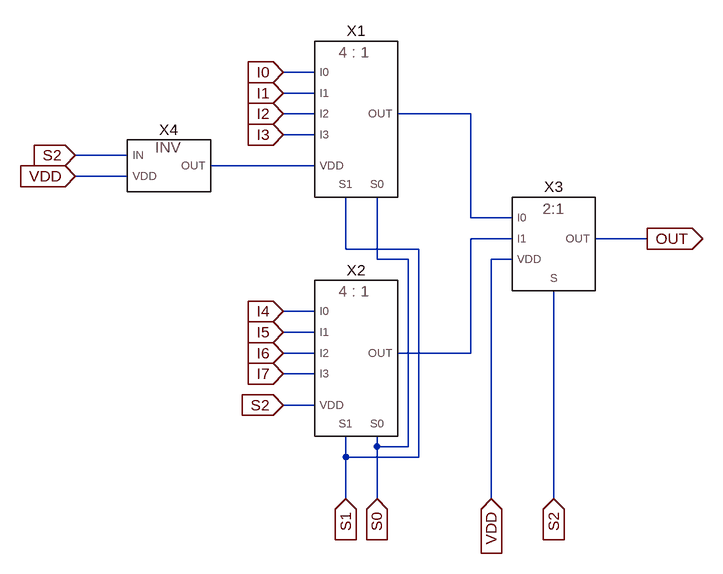
[diagram p0: schematic Mux8to1CMOS.asc]
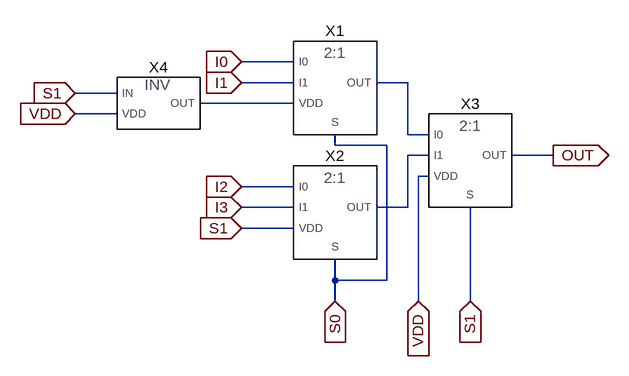
[diagram p1: sub-circuit mux4to1cmos.asc]
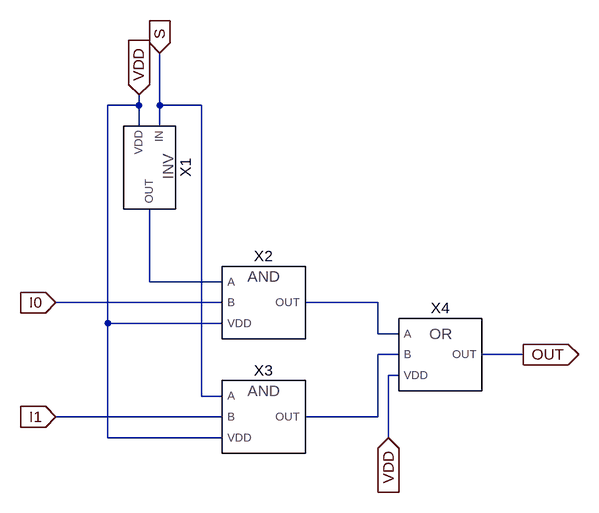
[diagram p2: sub-circuit mux2to1cmos.asc]
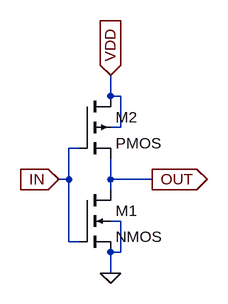
[diagram p3: sub-circuit invcmos.asc]
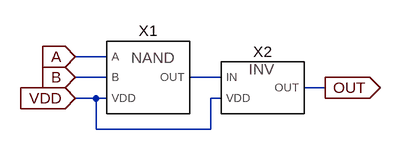
[diagram p4: sub-circuit andcmos.asc]
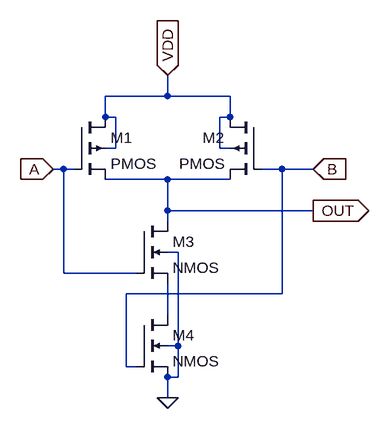
[diagram p5: sub-circuit nandcmos.asc]
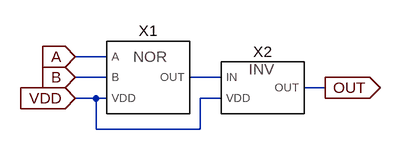
[diagram p6: sub-circuit orcmos.asc]
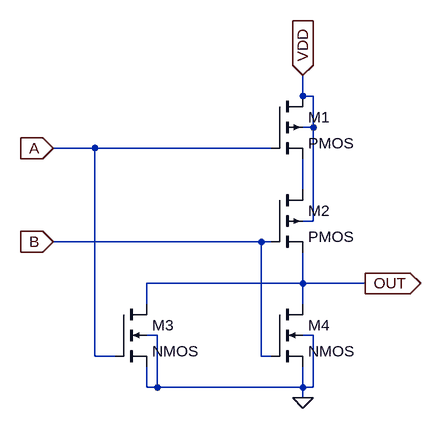
[diagram p7: sub-circuit norcmos.asc]
Mux8to1CMOS.asc, the LTspice schematic file:
Version 4
SHEET 1 880 812
WIRE 176 48 128 48
WIRE 176 80 128 80
WIRE 176 112 128 112
WIRE 416 112 304 112
WIRE 176 144 128 144
WIRE -112 176 -192 176
WIRE 176 192 16 192
WIRE -112 208 -192 208
WIRE 416 272 416 112
WIRE 480 272 416 272
WIRE 480 304 416 304
WIRE 688 304 608 304
WIRE 224 320 224 240
WIRE 336 320 224 320
WIRE 272 336 272 240
WIRE 320 336 272 336
WIRE 480 336 448 336
WIRE 176 416 128 416
WIRE 176 448 128 448
WIRE 176 480 128 480
WIRE 416 480 416 304
WIRE 416 480 304 480
WIRE 176 512 128 512
WIRE 176 560 128 560
WIRE 272 624 272 608
WIRE 320 624 320 336
WIRE 320 624 272 624
WIRE 224 640 224 608
WIRE 336 640 336 320
WIRE 336 640 224 640
WIRE 224 704 224 640
WIRE 272 704 272 624
WIRE 448 704 448 336
WIRE 544 704 544 384
FLAG 448 704 VDD
IOPIN 448 704 In
FLAG 224 704 S1
IOPIN 224 704 In
FLAG 272 704 S0
IOPIN 272 704 In
FLAG 544 704 S2
IOPIN 544 704 In
FLAG 688 304 OUT
IOPIN 688 304 Out
FLAG 128 48 I0
IOPIN 128 48 In
FLAG 128 80 I1
IOPIN 128 80 In
FLAG 128 112 I2
IOPIN 128 112 In
FLAG 128 144 I3
IOPIN 128 144 In
FLAG 128 416 I4
IOPIN 128 416 In
FLAG 128 448 I5
IOPIN 128 448 In
FLAG 128 480 I6
IOPIN 128 480 In
FLAG 128 512 I7
IOPIN 128 512 In
FLAG -192 176 S2
IOPIN -192 176 In
FLAG -192 208 VDD
IOPIN -192 208 In
FLAG 128 560 S2
IOPIN 128 560 In
SYMBOL Mux4to1CMOS 240 128 R0
SYMATTR InstName X1
SYMBOL Mux4to1CMOS 240 496 R0
SYMATTR InstName X2
SYMBOL Mux2to1CMOS 544 320 R0
SYMATTR InstName X3
SYMBOL InvCMOS -48 192 R0
SYMATTR InstName X4

mux4to1cmos.asc, the sub-circuit schematic file:
Version 4
SHEET 1 880 680
WIRE 160 48 80 48
WIRE 160 80 80 80
WIRE 336 80 288 80
WIRE -112 96 -176 96
WIRE 160 112 16 112
WIRE -112 128 -176 128
WIRE 336 160 336 80
WIRE 368 160 336 160
WIRE 224 176 224 160
WIRE 304 176 224 176
WIRE 368 192 336 192
WIRE 560 192 496 192
WIRE 368 224 352 224
WIRE 160 240 80 240
WIRE 160 272 80 272
WIRE 336 272 336 192
WIRE 336 272 288 272
WIRE 160 304 80 304
WIRE 224 384 224 352
WIRE 304 384 304 176
WIRE 304 384 224 384
WIRE 224 416 224 384
WIRE 352 416 352 224
WIRE 432 416 432 272
FLAG 352 416 VDD
IOPIN 352 416 In
FLAG 80 48 I0
IOPIN 80 48 In
FLAG 80 80 I1
IOPIN 80 80 In
FLAG 80 240 I2
IOPIN 80 240 In
FLAG 80 272 I3
IOPIN 80 272 In
FLAG 560 192 OUT
IOPIN 560 192 Out
FLAG 224 416 S0
IOPIN 224 416 In
FLAG 432 416 S1
IOPIN 432 416 In
FLAG -176 96 S1
IOPIN -176 96 In
FLAG -176 128 VDD
IOPIN -176 128 In
FLAG 80 304 S1
IOPIN 80 304 In
SYMBOL Mux2to1CMOS 224 96 R0
SYMATTR InstName X1
SYMBOL Mux2to1CMOS 224 288 R0
SYMATTR InstName X2
SYMBOL Mux2to1CMOS 432 208 R0
SYMATTR InstName X3
SYMBOL InvCMOS -48 112 R0
SYMATTR InstName X4

mux2to1cmos.asc, the sub-circuit schematic file:
Version 4
SHEET 1 880 680
WIRE 176 -16 176 -32
WIRE 176 -16 128 -16
WIRE 208 -16 208 -96
WIRE 272 -16 208 -16
WIRE 176 16 176 -16
WIRE 208 16 208 -16
WIRE 192 256 192 144
WIRE 304 256 192 256
WIRE 304 288 48 288
WIRE 544 288 432 288
WIRE 128 320 128 -16
WIRE 304 320 128 320
WIRE 544 336 544 288
WIRE 576 336 544 336
WIRE 576 368 544 368
WIRE 768 368 704 368
WIRE 576 400 560 400
WIRE 272 432 272 -16
WIRE 304 432 272 432
WIRE 304 464 48 464
WIRE 544 464 544 368
WIRE 544 464 432 464
WIRE 128 496 128 320
WIRE 304 496 128 496
WIRE 560 496 560 400
FLAG 176 -32 VDD
IOPIN 176 -32 In
FLAG 208 -96 S
IOPIN 208 -96 In
FLAG 48 288 I0
IOPIN 48 288 In
FLAG 48 464 I1
IOPIN 48 464 In
FLAG 560 496 VDD
IOPIN 560 496 In
FLAG 768 368 OUT
IOPIN 768 368 Out
SYMBOL InvCMOS 192 80 R90
SYMATTR InstName X1
SYMBOL AndCMOS 368 288 R0
SYMATTR InstName X2
SYMBOL AndCMOS 368 464 R0
SYMATTR InstName X3
SYMBOL OrCMOS 640 368 R0
SYMATTR InstName X4

invcmos.asc, the sub-circuit schematic file:
Version 4
SHEET 1 880 680
WIRE 208 32 208 0
WIRE 224 32 208 32
WIRE 224 80 224 32
WIRE 224 80 208 80
WIRE 160 112 144 112
WIRE 144 160 144 112
WIRE 144 160 128 160
WIRE 208 160 208 128
WIRE 272 160 208 160
WIRE 208 176 208 160
WIRE 224 224 208 224
WIRE 144 256 144 160
WIRE 160 256 144 256
WIRE 224 272 224 224
WIRE 224 272 208 272
WIRE 208 304 208 272
FLAG 208 304 0
FLAG 208 0 VDD
IOPIN 208 0 In
FLAG 128 160 IN
IOPIN 128 160 In
FLAG 272 160 OUT
IOPIN 272 160 Out
SYMBOL nmos4 160 176 R0
SYMATTR InstName M1
SYMATTR Value2 l=65nm w=65nm
SYMBOL pmos4 160 32 R0
SYMATTR InstName M2
SYMATTR Value2 l=65nm w=162.5nm

andcmos.asc, the sub-circuit schematic file:
Version 4
SHEET 1 880 680
WIRE 112 112 64 112
WIRE 112 144 64 144
WIRE 288 144 240 144
WIRE 448 160 416 160
WIRE 96 176 64 176
WIRE 112 176 96 176
WIRE 288 176 272 176
WIRE 96 224 96 176
WIRE 272 224 272 176
WIRE 272 224 96 224
FLAG 64 112 A
IOPIN 64 112 In
FLAG 64 144 B
IOPIN 64 144 In
FLAG 64 176 VDD
IOPIN 64 176 In
FLAG 448 160 OUT
IOPIN 448 160 Out
SYMBOL NandCMOS 176 144 R0
SYMATTR InstName X1
SYMBOL InvCMOS 352 160 R0
SYMATTR InstName X2

nandcmos.asc, the sub-circuit schematic file:
Version 4
SHEET 1 880 680
WIRE -112 -160 -112 -192
WIRE -112 -160 -208 -160
WIRE -16 -160 -112 -160
WIRE -208 -128 -208 -160
WIRE -192 -128 -208 -128
WIRE -16 -128 -16 -160
WIRE -16 -128 -32 -128
WIRE -192 -80 -192 -128
WIRE -192 -80 -208 -80
WIRE -32 -80 -32 -128
WIRE -16 -80 -32 -80
WIRE -272 -48 -288 -48
WIRE -256 -48 -272 -48
WIRE 64 -48 32 -48
WIRE 112 -48 64 -48
WIRE -112 -32 -208 -32
WIRE -16 -32 -112 -32
WIRE -112 16 -112 -32
WIRE 112 16 -112 16
WIRE -112 32 -112 16
WIRE -96 80 -112 80
WIRE -272 112 -272 -48
WIRE -160 112 -272 112
WIRE 64 144 64 -48
WIRE 64 144 -176 144
WIRE -112 176 -112 128
WIRE -96 224 -96 80
WIRE -96 224 -112 224
WIRE -176 256 -176 144
WIRE -160 256 -176 256
WIRE -96 272 -96 224
WIRE -96 272 -112 272
WIRE -112 304 -112 272
FLAG -112 304 0
FLAG -112 -192 VDD
IOPIN -112 -192 In
FLAG -288 -48 A
IOPIN -288 -48 In
FLAG 112 -48 B
IOPIN 112 -48 In
FLAG 112 16 OUT
IOPIN 112 16 Out
SYMBOL pmos4 -256 -128 R0
SYMATTR InstName M1
SYMATTR Value2 l=65nm w=162.5nm
SYMBOL pmos4 32 -128 M0
SYMATTR InstName M2
SYMATTR Value2 l=65nm w=162.5nm
SYMBOL nmos4 -160 32 R0
SYMATTR InstName M3
SYMATTR Value2 l=65nm w=65nm
SYMBOL nmos4 -160 176 R0
SYMATTR InstName M4
SYMATTR Value2 l=65nm w=65nm

orcmos.asc, the sub-circuit schematic file:
Version 4
SHEET 1 880 680
WIRE 112 128 64 128
WIRE 112 160 64 160
WIRE 288 160 240 160
WIRE 448 176 416 176
WIRE 96 192 64 192
WIRE 112 192 96 192
WIRE 288 192 256 192
WIRE 96 240 96 192
WIRE 256 240 256 192
WIRE 256 240 96 240
FLAG 64 128 A
IOPIN 64 128 In
FLAG 64 160 B
IOPIN 64 160 In
FLAG 64 192 VDD
IOPIN 64 192 In
FLAG 448 176 OUT
IOPIN 448 176 Out
SYMBOL NorCMOS 176 160 R0
SYMATTR InstName X1
SYMBOL InvCMOS 352 176 R0
SYMATTR InstName X2

norcmos.asc, the sub-circuit schematic file:
Version 4
SHEET 1 880 680
WIRE 224 16 224 -16
WIRE 240 16 224 16
WIRE 240 64 240 16
WIRE 240 64 224 64
WIRE -96 96 -160 96
WIRE 176 96 -96 96
WIRE 224 160 224 112
WIRE 240 208 240 64
WIRE 240 208 224 208
WIRE 160 240 -160 240
WIRE 176 240 160 240
WIRE 224 304 224 256
WIRE 224 304 -16 304
WIRE 320 304 224 304
WIRE -16 336 -16 304
WIRE 224 336 224 304
WIRE 0 384 -16 384
WIRE 240 384 224 384
WIRE -96 416 -96 96
WIRE -64 416 -96 416
WIRE 160 416 160 240
WIRE 176 416 160 416
WIRE -16 464 -16 432
WIRE 0 464 0 384
WIRE 0 464 -16 464
WIRE 224 464 224 432
WIRE 224 464 0 464
WIRE 240 464 240 384
WIRE 240 464 224 464
WIRE 224 480 224 464
FLAG 224 480 0
FLAG 224 -16 VDD
IOPIN 224 -16 In
FLAG -160 96 A
IOPIN -160 96 In
FLAG -160 240 B
IOPIN -160 240 In
FLAG 320 304 OUT
IOPIN 320 304 Out
SYMBOL pmos4 176 16 R0
SYMATTR InstName M1
SYMATTR Value2 l=65nm w=162.5nm
SYMBOL pmos4 176 160 R0
SYMATTR InstName M2
SYMATTR Value2 l=65nm w=162.5nm
SYMBOL nmos4 -64 336 R0
SYMATTR InstName M3
SYMATTR Value2 l=65nm w=65nm
SYMBOL nmos4 176 336 R0
SYMATTR InstName M4
SYMATTR Value2 l=65nm w=65nm

The netlist it stands for:
* Mux8to1CMOS.asc
XX1 I0 I1 I2 I3 S0 S1 N002 N001 mux4to1cmos
XX2 I4 I5 I6 I7 S0 S1 S2 N003 mux4to1cmos
XX3 N001 N003 S2 VDD OUT mux2to1cmos
XX4 S2 VDD N002 invcmos

* block symbol definitions
.subckt mux4to1cmos I0 I1 I2 I3 S0 S1 VDD OUT
XX1 I0 I1 S0 N002 N001 mux2to1cmos
XX2 I2 I3 S0 S1 N003 mux2to1cmos
XX3 N001 N003 S1 VDD OUT mux2to1cmos
XX4 S1 VDD N002 invcmos
.ends mux4to1cmos

.subckt mux2to1cmos I0 I1 S VDD OUT
XX1 S VDD N001 invcmos
XX2 N001 I0 VDD N002 andcmos
XX3 S I1 VDD N003 andcmos
XX4 N002 N003 VDD OUT orcmos
.ends mux2to1cmos

.subckt invcmos IN VDD OUT
M1 OUT IN 0 0 NMOS l=65nm w=65nm
M2 VDD IN OUT VDD PMOS l=65nm w=162.5nm
.ends invcmos

.subckt andcmos A B VDD OUT
XX1 A B VDD N001 nandcmos
XX2 N001 VDD OUT invcmos
.ends andcmos

.subckt nandcmos A B VDD OUT
M1 VDD A OUT VDD PMOS l=65nm w=162.5nm
M2 VDD B OUT VDD PMOS l=65nm w=162.5nm
M3 OUT A N001 0 NMOS l=65nm w=65nm
M4 N001 B 0 0 NMOS l=65nm w=65nm
.ends nandcmos

.subckt orcmos A B VDD OUT
XX1 A B VDD N001 norcmos
XX2 N001 VDD OUT invcmos
.ends orcmos

.subckt norcmos A B VDD OUT
M1 VDD A N001 VDD PMOS l=65nm w=162.5nm
M2 N001 B OUT VDD PMOS l=65nm w=162.5nm
M3 OUT A 0 0 NMOS l=65nm w=65nm
M4 OUT B 0 0 NMOS l=65nm w=65nm
.ends norcmos

.model NMOS NMOS
.model PMOS PMOS
.lib standard.mos
.backanno
.end